# Altium schematic sheet VREG_12V.SchDoc
size A4
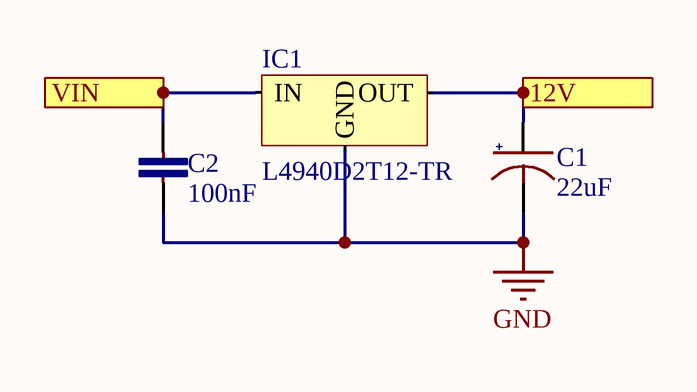
[diagram p0: VREG_12V.SchDoc]

## Parts
C1  22uF  [CAP ALUM 5X5]
C2  100nF  [CAP CER 0603]
IC1  L4940D2T12-TR  [D2PAK]

## Ports
12V (out), VIN (in)

## Nets
GND: C1.2 C2.2 IC1.2(GND)
12V: C1.1 IC1.3(OUT) ; port 12V
VIN: C2.1 IC1.1(IN) ; port VIN

## Library data of the parts
C1 = CAP ALUM 25V 22uF: Aluminum Electrolytic Capacitors - SMD 25V 22uF 20% AEC-Q200; Mfr: KEMET; Mfr Nr: EDH226M025S9DAA; Type: Surface Mount Aluminum Electrolytic Capacitor; Dimensions: 5x5mm; Voltage Rating: 25V; Series: EDH; Value: 22uF
C2 = CAP CER 0603 25V 100nF: Multilayer Ceramic Capacitors MLCC - SMD/SMT 25V 0.1uF 0603 Y5V -20/+80%; Mfr Nr: C0603C104Z3VACTU; Mfr: KEMET; Type: Ceramic Capacitor; Dimensions: 0603 (1608 metric); Voltage Rating: 25V; Series: SMD Comm Y5V; Value: 100nF
IC1 = L4940D2T12-TR: LDO Voltage Regulators 1.5A Regulator Lo Drop; Mfr: STMicroelectronics; Package: D2PAK; Series: L4940